# EAGLE schematic midi-sch (EAGLE 6.2)
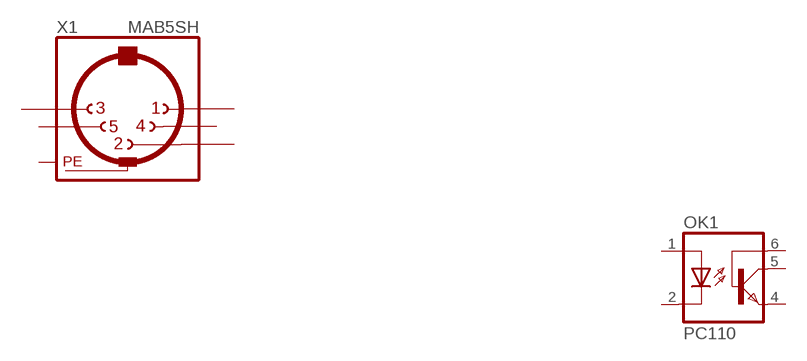
[diagram p0: schematic, sheet 1]

## Parts
OK1  PC110  [DIL06]
X1  MAB5SH  [MAB5SH]
Unconnected: OK1.1(A) OK1.2(C) OK1.4(EMI) OK1.5(COL) OK1.6(BAS) X1.1 X1.2 X1.3 X1.4 X1.5

## Power pins joined to a net without a drawn wire
PE: X1.PE X1.PE@(PE)

## Library data of the parts
OK1 = optocoupler:PC110: SHARP OPTO COUPLER; OC_FARNELL: unknown; OC_NEWARK: unknown
X1 = con-hirschmann:MAB5SH: Female CONNECTOR 5 pins 90 deg. with shield, horizontal (DIN 41524); OC_FARNELL: 809883; OC_NEWARK: unknown